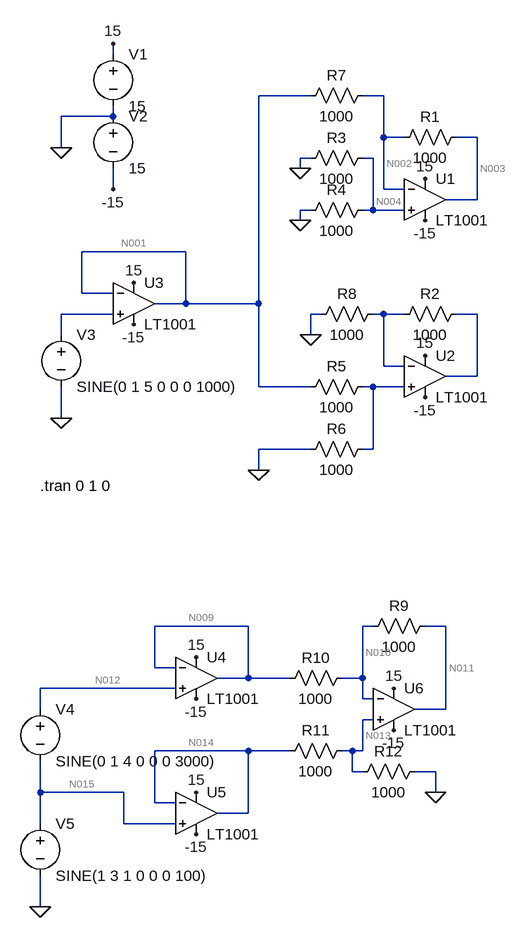
[diagram p0: schematic Diff_in_test.asc]
Diff_in_test.asc, the LTspice schematic file:
Version 4
SHEET 1 880 680
WIRE -304 -736 -304 -752
WIRE 0 -672 -80 -672
WIRE 112 -672 80 -672
WIRE -304 -640 -304 -656
WIRE -304 -640 -384 -640
WIRE 112 -608 112 -672
WIRE 144 -608 112 -608
WIRE 256 -608 224 -608
WIRE -384 -592 -384 -640
WIRE 0 -576 -16 -576
WIRE 96 -576 80 -576
WIRE -16 -560 -16 -576
WIRE -304 -528 -304 -560
WIRE 112 -528 112 -608
WIRE 144 -528 112 -528
WIRE 256 -512 256 -608
WIRE 256 -512 208 -512
WIRE 0 -496 -16 -496
WIRE 96 -496 96 -576
WIRE 96 -496 80 -496
WIRE 144 -496 96 -496
WIRE -16 -480 -16 -496
WIRE -192 -432 -352 -432
WIRE -352 -368 -352 -432
WIRE -304 -368 -352 -368
WIRE -192 -352 -192 -432
WIRE -192 -352 -240 -352
WIRE -80 -352 -80 -672
WIRE -80 -352 -192 -352
WIRE -304 -336 -384 -336
WIRE 16 -336 0 -336
WIRE 112 -336 96 -336
WIRE 144 -336 112 -336
WIRE 256 -336 224 -336
WIRE -384 -304 -384 -336
WIRE 0 -304 0 -336
WIRE 112 -256 112 -336
WIRE 144 -256 112 -256
WIRE 256 -240 256 -336
WIRE 256 -240 208 -240
WIRE -80 -224 -80 -352
WIRE 0 -224 -80 -224
WIRE 96 -224 80 -224
WIRE 144 -224 96 -224
WIRE -384 -176 -384 -224
WIRE 0 -128 -80 -128
WIRE 96 -128 96 -224
WIRE 96 -128 80 -128
WIRE -80 -96 -80 -128
WIRE -96 144 -240 144
WIRE 96 144 80 144
WIRE 208 144 176 144
WIRE -240 208 -240 144
WIRE -208 208 -240 208
WIRE -96 224 -96 144
WIRE -96 224 -144 224
WIRE -32 224 -96 224
WIRE 80 224 80 144
WIRE 80 224 48 224
WIRE -208 240 -416 240
WIRE 80 256 80 224
WIRE 96 256 80 256
WIRE -416 272 -416 240
WIRE 208 272 208 144
WIRE 208 272 160 272
WIRE 96 288 80 288
WIRE -96 336 -240 336
WIRE -32 336 -96 336
WIRE 64 336 48 336
WIRE 80 336 80 288
WIRE 80 336 64 336
WIRE 64 368 64 336
WIRE 80 368 64 368
WIRE 192 368 160 368
WIRE -416 400 -416 352
WIRE -288 400 -416 400
WIRE 192 400 192 368
WIRE -240 416 -240 336
WIRE -208 416 -240 416
WIRE -96 432 -96 336
WIRE -96 432 -144 432
WIRE -416 448 -416 400
WIRE -288 448 -288 400
WIRE -208 448 -288 448
WIRE -416 576 -416 528
FLAG -16 -560 0
FLAG -16 -480 0
FLAG -80 -96 0
FLAG 0 -304 0
FLAG -304 -752 15
FLAG -304 -528 -15
FLAG -384 -592 0
FLAG 176 -544 15
FLAG -272 -384 15
FLAG 176 -272 15
FLAG 176 -208 -15
FLAG -272 -320 -15
FLAG 176 -480 -15
FLAG -384 -176 0
FLAG 128 240 15
FLAG -176 192 15
FLAG -176 400 15
FLAG -176 256 -15
FLAG -176 464 -15
FLAG 128 304 -15
FLAG -416 576 0
FLAG 192 400 0
SYMBOL OpAmps\\LT1001 176 -576 R0
SYMATTR InstName U1
SYMBOL OpAmps\\LT1001 176 -304 R0
SYMATTR InstName U2
SYMBOL res 240 -624 R90
WINDOW 0 0 56 VBottom 2
WINDOW 3 32 56 VTop 2
SYMATTR InstName R1
SYMATTR Value 1000
SYMBOL res 240 -352 R90
WINDOW 0 0 56 VBottom 2
WINDOW 3 32 56 VTop 2
SYMATTR InstName R2
SYMATTR Value 1000
SYMBOL res 96 -592 R90
WINDOW 0 0 56 VBottom 2
WINDOW 3 32 56 VTop 2
SYMATTR InstName R3
SYMATTR Value 1000
SYMBOL res 96 -512 R90
WINDOW 0 0 56 VBottom 2
WINDOW 3 32 56 VTop 2
SYMATTR InstName R4
SYMATTR Value 1000
SYMBOL res 96 -240 R90
WINDOW 0 0 56 VBottom 2
WINDOW 3 32 56 VTop 2
SYMATTR InstName R5
SYMATTR Value 1000
SYMBOL res 96 -144 R90
WINDOW 0 0 56 VBottom 2
WINDOW 3 32 56 VTop 2
SYMATTR InstName R6
SYMATTR Value 1000
SYMBOL res 96 -688 R90
WINDOW 0 0 56 VBottom 2
WINDOW 3 32 56 VTop 2
SYMATTR InstName R7
SYMATTR Value 1000
SYMBOL res 112 -352 R90
WINDOW 0 0 56 VBottom 2
WINDOW 3 32 56 VTop 2
SYMATTR InstName R8
SYMATTR Value 1000
SYMBOL OpAmps\\LT1001 -272 -416 R0
SYMATTR InstName U3
SYMBOL voltage -304 -752 R0
WINDOW 123 0 0 Left 0
WINDOW 39 0 0 Left 0
SYMATTR InstName V1
SYMATTR Value 15
SYMBOL voltage -304 -656 R0
WINDOW 123 0 0 Left 0
WINDOW 39 0 0 Left 0
SYMATTR InstName V2
SYMATTR Value 15
SYMBOL voltage -384 -320 R0
WINDOW 123 0 0 Left 0
WINDOW 39 0 0 Left 0
SYMATTR InstName V3
SYMATTR Value SINE(0 1 5 0 0 0 1000)
SYMBOL OpAmps\\LT1001 -176 160 R0
SYMATTR InstName U4
SYMBOL OpAmps\\LT1001 -176 368 R0
SYMATTR InstName U5
SYMBOL OpAmps\\LT1001 128 208 R0
SYMATTR InstName U6
SYMBOL res 192 128 R90
WINDOW 0 0 56 VBottom 2
WINDOW 3 32 56 VTop 2
SYMATTR InstName R9
SYMATTR Value 1000
SYMBOL res 64 208 R90
WINDOW 0 0 56 VBottom 2
WINDOW 3 32 56 VTop 2
SYMATTR InstName R10
SYMATTR Value 1000
SYMBOL res 64 320 R90
WINDOW 0 0 56 VBottom 2
WINDOW 3 32 56 VTop 2
SYMATTR InstName R11
SYMATTR Value 1000
SYMBOL res 176 352 R90
WINDOW 0 0 56 VBottom 2
WINDOW 3 32 56 VTop 2
SYMATTR InstName R12
SYMATTR Value 1000
SYMBOL voltage -416 256 R0
WINDOW 123 0 0 Left 0
WINDOW 39 0 0 Left 0
SYMATTR InstName V4
SYMATTR Value SINE(0 1 4 0 0 0 3000)
SYMBOL voltage -416 432 R0
WINDOW 123 0 0 Left 0
WINDOW 39 0 0 Left 0
SYMATTR InstName V5
SYMATTR Value SINE(1 3 1 0 0 0 100)
TEXT -416 -72 Left 2 !.tran 0 1 0

The netlist it stands for:
* Diff_in_test.asc
XU1 N004 N002 15 -15 N003 LT1001  ; pins In+ In- V+ V- OUT
XU2 N008 N006 15 -15 N007 LT1001  ; pins In+ In- V+ V- OUT
R1 N003 N002 1000
R2 N007 N006 1000
R3 N004 0 1000
R4 N004 0 1000
R5 N008 N001 1000
R6 N008 0 1000
R7 N002 N001 1000
R8 N006 0 1000
XU3 N005 N001 15 -15 N001 LT1001  ; pins In+ In- V+ V- OUT
V1 15 0 15
V2 0 -15 15
V3 N005 0 SINE(0 1 5 0 0 0 1000)
XU4 N012 N009 15 -15 N009 LT1001  ; pins In+ In- V+ V- OUT
XU5 N015 N014 15 -15 N014 LT1001  ; pins In+ In- V+ V- OUT
XU6 N013 N010 15 -15 N011 LT1001  ; pins In+ In- V+ V- OUT
R9 N011 N010 1000
R10 N010 N009 1000
R11 N013 N014 1000
R12 0 N013 1000
V4 N012 N015 SINE(0 1 4 0 0 0 3000)
V5 N015 0 SINE(1 3 1 0 0 0 100)
.tran 0 1 0
.lib LTC.lib
.backanno
.end

* Results of the author's LTspice run, read from the files saved beside the schematic
* Operating Point, zero values left out:
*   V(15) = 15 V
*   V(-15) = -15 V
*   V(n009) = 1 V
*   V(n012) = 1 V
*   V(n014) = 1 V
*   V(n015) = 1 V
*   V(n010) = 500 mV
*   V(n013) = 500 mV
*   V(n011) = 44.88 nV
*   I(R12) = -500 µA
*   I(R11) = -500 µA
*   I(R10) = -500 µA
*   I(R9) = -500 µA
*   I(V5) = -3.608 pA
*   I(V4) = -1.804 pA
*   I(V2) = -13.27 mA
*   I(V1) = -13.77 mA
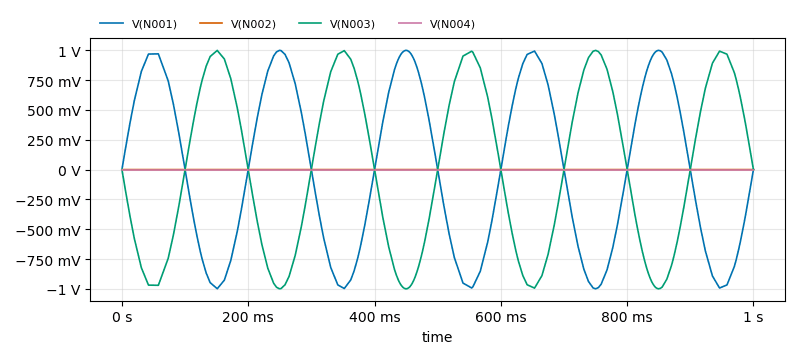
[diagram p1: Transient Analysis of Diff_in_test.asc, plotted from the saved traces]
* Transient Analysis, 1 run:
*   V(N001): min -999.8 mV, max 999.7 mV, average 553.5 µV, rms 704.6 mV, last -5.801 µV
*   V(N002): min -6.214 µV, max 6.238 µV, average 2.572 nV, rms 4.407 µV, last 6.039 µV
*   V(N003): min -999.7 mV, max 999.8 mV, average -553.5 µV, rms 704.6 mV, last 18.64 µV
*   V(N004): min -529.1 pV, max 4.627 nV, average 1.568 pV, rms 95.19 pV, last 41.19 pV